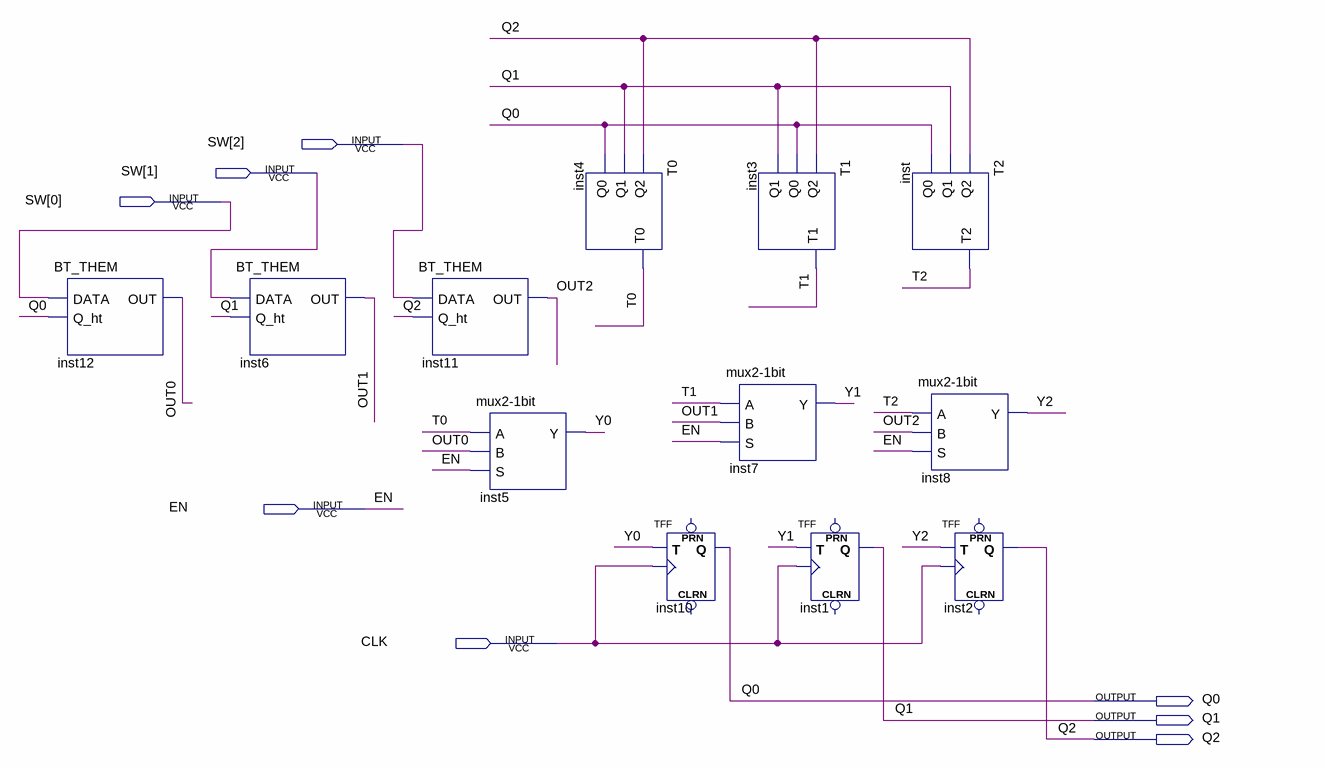
[diagram p0: schematic sheet]
// Quartus schematic LAb1_them.bdf as structural Verilog: 12 symbols, 8 pins
module LAb1_them (
  input  [2:0] SW,
  input  EN,
  input  CLK,
  output Q0,
  output Q1,
  output Q2
);

  wire OUT0, OUT1, OUT2, T0, T1, T2, Y0, Y1, Y2;

  BT_THEM inst12 (.DATA(SW[0]), .Q_ht(Q0), .OUT(OUT0));
  BT_THEM inst6 (.DATA(SW[1]), .Q_ht(Q1), .OUT(OUT1));
  BT_THEM inst11 (.DATA(SW[2]), .Q_ht(Q2), .OUT(OUT2));
  \mux2-1bit  inst5 (.A(T0), .B(OUT0), .S(EN), .Y(Y0));
  T0 inst4 (.Q2(Q2), .Q1(Q1), .Q0(Q0), .T0(T0));
  \mux2-1bit  inst7 (.A(T1), .B(OUT1), .S(EN), .Y(Y1));
  TFF inst10 (.T(Y0), .CLK(CLK), .Q(Q0));  // open: PRN, CLRN
  T1 inst3 (.Q2(Q2), .Q0(Q0), .Q1(Q1), .T1(T1));
  TFF inst1 (.T(Y1), .CLK(CLK), .Q(Q1));  // open: PRN, CLRN
  T2 inst (.Q2(Q2), .Q1(Q1), .Q0(Q0), .T2(T2));
  \mux2-1bit  inst8 (.A(T2), .B(OUT2), .S(EN), .Y(Y2));
  TFF inst2 (.T(Y2), .CLK(CLK), .Q(Q2));  // open: PRN, CLRN
endmodule
